# EAGLE design valve adapter-OSH (EAGLE 7.6.0)
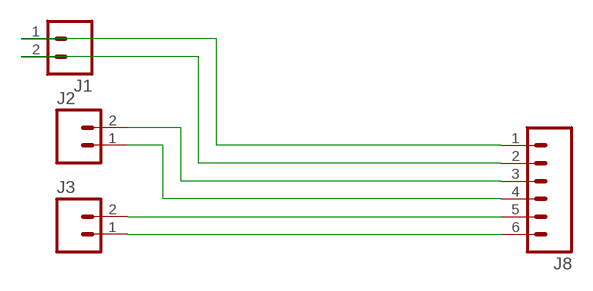
[diagram p0: schematic, sheet 1]

## Parts
J1  M025MM  [SCREWTERMINAL-5MM-2]
J2  M025MM  [SCREWTERMINAL-5MM-2]
J3  M025MM  [SCREWTERMINAL-5MM-2]
J8  M06LOCK_LONGPADS  [1X06_LOCK_LONGPADS]

## Nets
N$1: J1.1 J8.1
N$2: J1.2 J8.2
N$3: J2.2 J8.3
N$4: J2.1 J8.4
N$6: J3.2 J8.5
N$7: J3.1 J8.6

## Library data of the parts
J1-J3 = SparkFun-Connectors:M02: Standard 2-pin 0.1" header. Use with - straight break away headers ( PRT-00116) - right angle break away headers (PRT-00553) - swiss pins (PRT-00743) - machine pins (PRT-00117) - female headers (PRT-00115) Molex polarized connector foot print use with: PRT-08233 with associated crimp pins and housings. 2.54_SCREWTERM for use with PRT-10571. 3.5mm Screw Terminal footprints for PRT-08084 5mm Screw Terminal footprints for use with PRT-08432; STOREFRONT_ID: PRT-08432
J8 = SparkFun-Connectors:M06: Header 6 Standard 6-pin 0.1" header. Use with straight break away headers (SKU : PRT-00116), right angle break away headers (PRT-00553), swiss pins (PRT-00743), machine pins (PRT-00117), and female headers (PRT-00115). Molex polarized connector foot print use with SKU : PRT-08094 with associated crimp pins and housings. NOTES ON THE VARIANTS LOCK and LOCK_LONGPADS... This footprint was designed to help hold the alignment of a through-hole component (i.e. 6-pin header) while soldering it into place. You may notice that each hole has been shifted either up or down by 0.005 of an inch from it's more standard position (which is a perfectly straight line). This slight alteration caused the pins (the squares in the middle) to touch the edges of the holes. Because they are alternating, it causes a "brace" to hold the component in place. 0.005 has proven to be the perfect amount of "off-center" position when using our standard breakaway headers. Although looks a little odd when you look at the bare footprint, once you have a header in there, the alteration is very hard to notice. Also,if you push a header all the way into place, it is covered up entirely on the bottom side. This idea of altering the position of holes to aid alignment will be further integrated into the Sparkfun Library for other footprints. It can help hold any component with 3 or more connection pins.

## Board
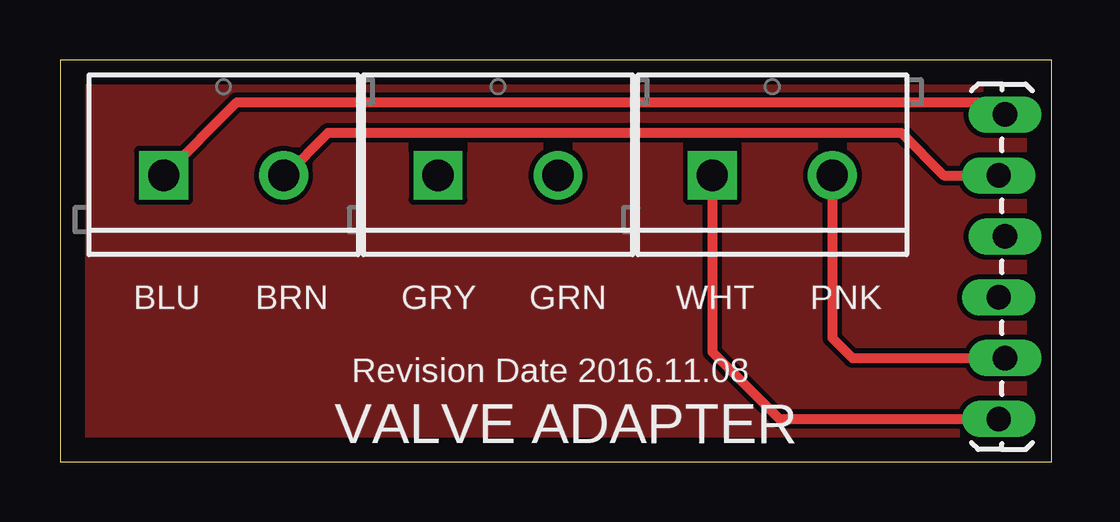
[diagram p1: board, top side]
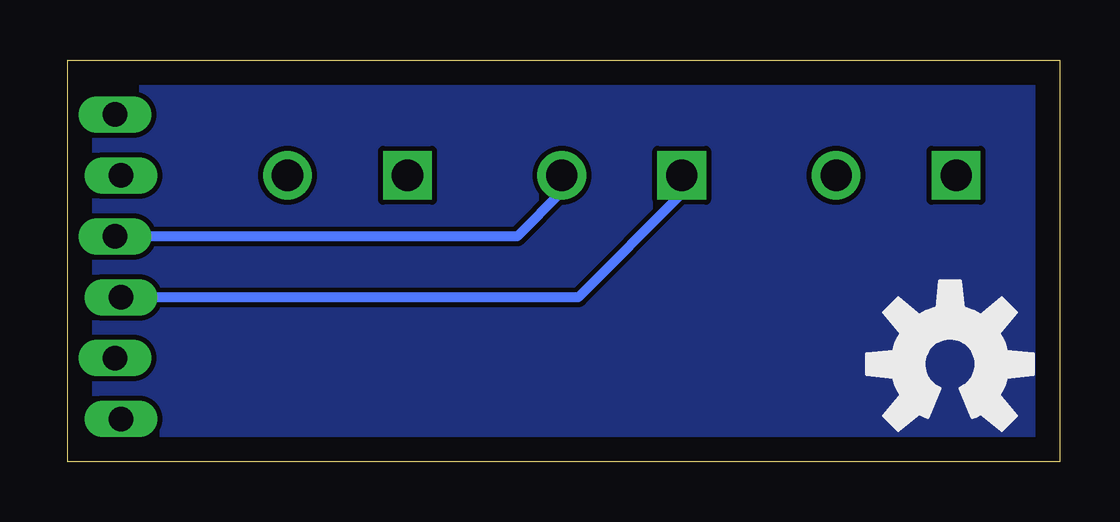
[diagram p2: board, bottom side, seen from below]

Size 41.33 x 16.75 mm. Coordinates in mm from the lower left corner, seen from the top.
Outline: 0,0 41.33,0 41.33,16.75 0,16.75 0,0
Copper layers (1*16): Top 0.035mm / dielectric 1.5mm / Bottom 0.035mm
Design rules "default": minimum track width 10mil, minimum drill 24mil, track to track 8mil, track to pad 8mil, pad to pad 8mil, via to via 8mil, smd to smd 8mil, copper to edge 40mil, drill to drill 8mil, minimum pad ring 10mil, minimum via ring 8mil, stop-mask expansion 4mil, vias tented up to drill 0mil, thermal gap 10mil

### Footprints (pad centres in the part's own frame; a part is rotated, then mirrored left to right if it is on the bottom)
SCREWTERMINAL-5MM-2 = drill 1.3 pad 2.032 square: 1 0,0 | drill 1.3 pad 2.032: 2 5,0
1X06_LOCK_LONGPADS = drill 1.016 long: 1 0,0; 2 2.54,-0.254; 3 5.08,0; 4 7.62,-0.254; 5 10.16,0; 6 12.7,-0.254

### Placement (x,y rotation side)
J1  4.32,11.94 0 top
J2  15.75,11.94 0 top
J3  27.18,11.94 0 top
J8  39.37,14.48 270 top
U$1  [OSHW-LOGO-L]  4.57,4.06 0 bottom

### Tracks (layer width: path | path; a pad name or v marks a point on that pad's centre or on a via)
GND
  pour Bottom: 0,16.76 41.4,16.76 41.4,0 0,0
  pour Top: 0,16.76 41.4,16.76 41.4,0 0,0
N$1
  Top 0.406: J1.1 7.37,14.99 38.86,14.99 J8.1
N$2
  Top 0.406: J1.2 9.4,11.94 11.18,13.72 35.05,13.72 36.83,11.94 J8.2
N$3
  Bottom 0.406: J2.2 20.75,11.26 22.61,9.4 J8.3
N$4
  Bottom 0.406: J2.1 15.75,11.18 20.07,6.86 J8.4
N$6
  Top 0.406: J3.2 32.18,5.16 33.02,4.32 J8.5
N$7
  Top 0.406: J3.1 27.18,4.57 29.97,1.78 J8.6

### Text on the board
tPlace: VALVE ADAPTER
tNames: BLU | BRN | GRY | GRN | WHT | PNK | Revision Date 2016.11.08